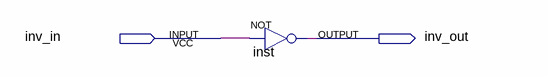
[diagram p0: schematic sheet]
// Quartus schematic test_symbol.bdf as structural Verilog: 1 symbols, 2 pins
module test_symbol (
  input  inv_in,
  output inv_out
);

  not inst (inv_out, inv_in);
endmodule
